# Altium schematic sheet MCU.SchDoc
size A4; SheetNumber: 3; SheetTotal: 4
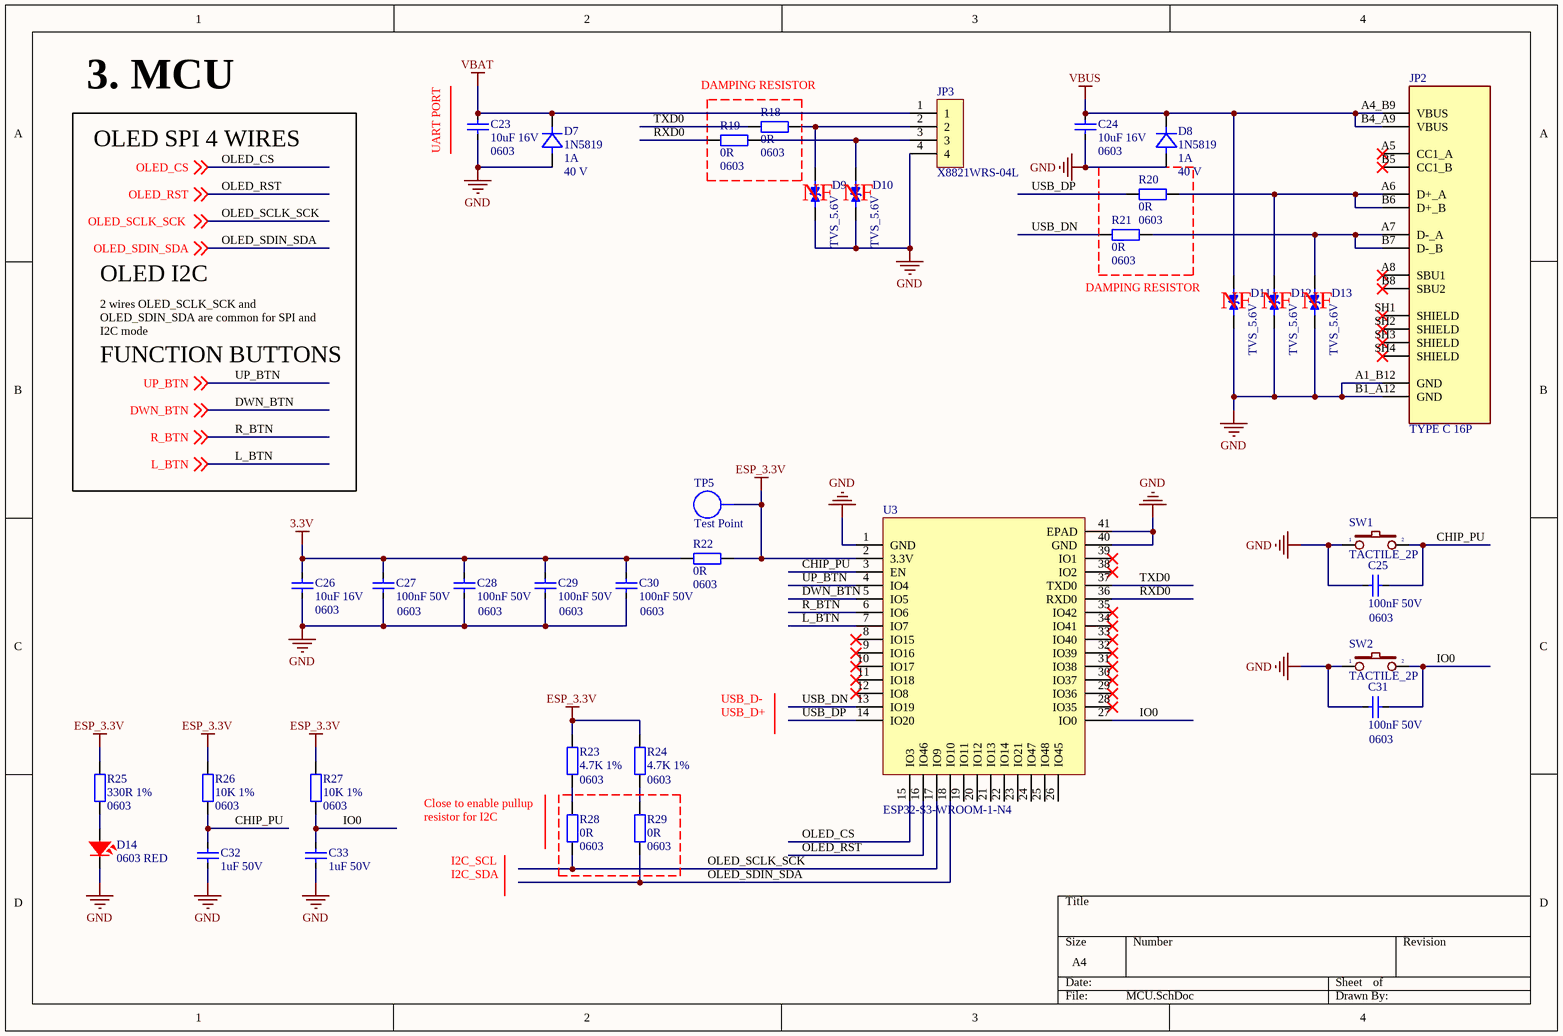
[diagram p0: MCU.SchDoc]

## Parts
C23  10uF 16V  Size: 0603  [CAP_SMD_0603]
C24  10uF 16V  Size: 0603  [CAP_SMD_0603]
C25  100nF 50V  Size: 0603  [CAP_SMD_0603]
C26  10uF 16V  Size: 0603  [CAP_SMD_0603]
C27  100nF 50V  Size: 0603  [CAP_SMD_0603]
C28  100nF 50V  Size: 0603  [CAP_SMD_0603]
C29  100nF 50V  Size: 0603  [CAP_SMD_0603]
C30  100nF 50V  Size: 0603  [CAP_SMD_0603]
C31  100nF 50V  Size: 0603  [CAP_SMD_0603]
C32  1uF 50V  [CAP_SMD_0603]
C33  1uF 50V  [CAP_SMD_0603]
D7  1N5819  Current - Average Rectified (Io): 1A  Voltage - DC Reverse (Vr) (Max): 40 V  [DIO-SMD-123]
D8  1N5819  Current - Average Rectified (Io): 1A  Voltage - DC Reverse (Vr) (Max): 40 V  [DIO-SMD-123]
D9  TVS_5.6V  [SOD_523]
D10  TVS_5.6V  [SOD_523]
D11  TVS_5.6V  [SOD_523]
D12  TVS_5.6V  [SOD_523]
D13  TVS_5.6V  [SOD_523]
D14  0603 RED  [LED-0603]
JP2  TYPE C 16P  [TYPE C 16P]
JP3  X8821WRS-04L  [CONN_X8821WRS-04L-LPSN]
R18  0R  Size: 0603  [RES_SMD_0603]
R19  0R  Size: 0603  [RES_SMD_0603]
R20  0R  Size: 0603  [RES_SMD_0603]
R21  0R  Size: 0603  [RES_SMD_0603]
R22  0R  Size: 0603  [RES_SMD_0603]
R23  4.7K 1%  Size: 0603  [RES_SMD_0603]
R24  4.7K 1%  Size: 0603  [RES_SMD_0603]
R25  330R 1%  Size: 0603  [RES_SMD_0603]
R26  10K 1%  Size: 0603  [RES_SMD_0603]
R27  10K 1%  Size: 0603  [RES_SMD_0603]
R28  0R  Size: 0603  [RES_SMD_0603]
R29  0R  Size: 0603  [RES_SMD_0603]
SW1  TACTILE_2P  [C&K SW 2P]
SW2  TACTILE_2P  [C&K SW 2P]
TP5  Test Point  [TEST_POINT]
U3  ESP32-S3-WROOM-1-N4  [ESP32-S3-WROOM-1]

## Nets
3.3V: C26.1 C27.2 C28.2 C29.2 C30.2 R22.2
ESP_3.3V: R22.1 R23.2 R24.2 R25.1 R26.2 R27.2 TP5.1 U3.2(3.3V)
GND: C23.2 C24.2 C25.1 C26.2 C27.1 C28.1 C29.1 C30.1 C31.1 C32.1 C33.1 D7.A D8.A D9.1 D10.1 D11.1 D12.1 D13.1 D14.2 JP2.A1_B12(GND) JP2.B1_A12(GND) JP3.4 SW1.1 SW2.1 U3.1(GND) U3.40(GND) U3.41(EPAD)
VBAT: C23.1 D7.C JP3.1
VBUS: C24.1 D8.C D11.2 JP2.A4_B9(VBUS) JP2.B4_A9(VBUS)
CHIP_PU: C25.2 C32.2 R26.1 SW1.2 U3.3(EN)
DWN_BTN: U3.5(IO5) ; off-sheet DWN_BTN
IO0: C31.2 C33.2 R27.1 SW2.2 U3.27(IO0)
L_BTN: U3.7(IO7) ; off-sheet L_BTN
OLED_CS: U3.15(IO3) ; off-sheet OLED_CS
OLED_RST: U3.16(IO46) ; off-sheet OLED_RST
OLED_SCLK_SCK: R28.2 U3.17(IO9) ; off-sheet OLED_SCLK_SCK   [also labelled OLED_SCLK_SCK ]
OLED_SDIN_SDA: R29.2 U3.18(IO10) ; off-sheet OLED_SDIN_SDA  [also labelled OLED_SDIN_SDA ]
R_BTN: U3.6(IO6) ; off-sheet R_BTN
RXD0: R19.2 U3.36(RXD0)
TXD0: R18.2 U3.37(TXD0)
UP_BTN: U3.4(IO4) ; off-sheet UP_BTN
USB_DN: R21.2 U3.13(IO19)
USB_DP: R20.2 U3.14(IO20)
NetD9_2: D9.2 JP3.2 R18.1
NetD10_2: D10.2 JP3.3 R19.1
NetD12_2: D12.2 JP2.A6(D+_A) JP2.B6(D+_B) R20.1
NetD13_2: D13.2 JP2.A7(D-_A) JP2.B7(D-_B) R21.1
NetD14_1: D14.1 R25.2
NetR23_1: R23.1 R28.1
NetR24_1: R24.1 R29.1

Not connected (* = marked no-connect by the designer): JP2 A5(CC1_A)* A8(SBU1)* B5(CC1_B)* B8(SBU2)* SH1(SHIELD)* SH2(SHIELD)* SH3(SHIELD)* SH4(SHIELD)*; U3 8(IO15)* 9(IO16)* 10(IO17)* 11(IO18)* 12(IO8)* 19(IO11) 20(IO12) 21(IO13) 22(IO14) 23(IO21) 24(IO47) 25(IO48) 26(IO45) 28(IO35)* 29(IO36)* 30(IO37)* 31(IO38)* 32(IO39)* 33(IO40)* 34(IO41)* 35(IO42)* 38(IO2)* 39(IO1)*

## Notes on the sheet
- 3. MCU
- DAMPING RESISTOR
- OLED SPI 4 WIRES
- (near C23) UART PORT
- (near D9) NF
- (near D10) NF
- OLED I2C
- (near D11) NF
- (near D12) NF
- (near D13) NF
- 2 wires OLED_SCLK_SCK and OLED_SDIN_SDA are common for SPI and I2C mode
- FUNCTION BUTTONS
- USB_D-
- USB_D+
- Close to enable pullup resistor for I2C
- I2C_SCL
- I2C_SDA

## Library data of the parts
C23 C24 C26 = C0603_MLCC_10uF_16V: 10 µF ±20% 16V Ceramic Capacitor X6S 0603 (1608 Metric); Manufacturer: Murata Electronics; Manufacture Part Number: GRM188C81C106MA73D; Packaging: Cut Tape (CT); Link: https://www.digikey.cn/en/products/detail/murata-electronics/GRM188C81C106MA73D/3900463; Price: $0.25
C25 C27-C31 = C0603_MLCC_100nF_50V: 0.1 µF ±10% 50V Ceramic Capacitor X7R 0603 (1608 Metric); Manufacturer: Samsung Electro-Mechanics; Manufacture Part Number: CL10B104KB8NNNC; Packaging: Cut Tape (CT); Link: https://www.digikey.cn/en/products/detail/samsung-electro-mechanics/CL10B104KB8NNNC/3886658; Price: $0.10
C32 C33 = C0603_MLCC_1uF_50V: 1 µF ±10% 50V Ceramic Capacitor X5R 0603 (1608 Metric); Manufacturer: Samsung Electro-Mechanics; Manufacture Part Number: CL10A105KB8NNNC; Packaging: Cut Tape (CT); Link: https://www.digikey.cn/en/products/detail/samsung-electro-mechanics/CL10A105KB8NNNC/3887518; Price: $0.14; Size: 0603
D7 D8 = 1N5819: Diode 40 V 1A Surface Mount SOD-123; Manufacturer: Diodes Incorporated; Manufacture Part Number: 1N5819HW-7-F; Voltage - Forward (Vf) (Max) @ If: 450 mV @ 1 A; Capacitance @ Vr, F: 60pF @ 4V, 1MHz; Packaging: Cut Tape (CT); Link: https://www.digikey.cn/en/products/detail/diodes-incorporated/1N5819HW-7-F/814970; Price: $0.43; Operating Temperature - Junction: -65°C ~ 125°C
D9-D13 = TVS_5.6V: 9.4A 18.6V 5.6V Bi-Directional 5V SOD-523 Electrostatic and Surge Protection (TVS/ESD) ROHS; Manufacturer: LRC; Manufacture Part Number: LESD5D5.0CT1G; Voltage - Reverse Standoff (Typ): 4V; Voltage - Breakdown (Min): 6V; Voltage - Clamping (Max) @ Ipp: 8V; Packaging: Cut Tape (CT); Link: https://www.lcsc.com/product-detail/New-Arrivals_Leshan-Radio-LESD5D5-0CT1G_C383211.html; Price: $ 0.0149
D14 = LED_0603_RED: Red 625nm LED Indication - Discrete 2V 0603 (1608 Metric); Manufacturer: Würth Elektronik; Manufacture Part Number: 150060RS75000; Packaging: Cut Tape (CT); Link: https://www.digikey.cn/en/products/detail/w%C3%BCrth-elektronik/150060RS75000/4489901; Price: $0.15
JP2 = TYPE_C_16P: USB-C (USB TYPE-C) USB 2.0 Receptacle Connector 24 (16+8 Dummy) Position Surface Mount, Right Angle; Through Hole; Manufacturer: Amphenol ICC (Commercial Products); Manufacture Part Number: 12402012E212A; Packaging: Cut Tape; Link: https://www.digikey.cn/en/products/detail/amphenol-cs-commercial-products/12402012E212A/13683192; Price: $0.79
JP3 = X8821WRS-04L: 1x4P 4P XH 1 Tin 2.5mm 4 3A Brass Surface Mount，Right Angle SMD,P=2.5mm,Surface Mount，Right Angle Wire To Board Connector ROHS; Manufacturer: XKB Connection; Manufacture Part Number: X8821WRS-04-9TSN; Link: https://www.lcsc.com/product-detail/Wire-To-Board-Connector_XKB-Connection-X8821WRS-04-9TSN_C397434.html; Price: $ 0.1564
R18-R22 R28 R29 = R0603_0R: 0 Ohms Jumper Chip Resistor 0603 (1608 Metric) Automotive AEC-Q200 Thick Film; Manufacturer: Stackpole Electronics Inc; Manufacture Part Number: RMCF0603ZT0R00; Packaging: Cut Tape (CT); Link: https://www.digikey.cn/en/products/detail/stackpole-electronics-inc/RMCF0603ZT0R00/1756908; Price: $0.10
R23 R24 = R0603_4.7K: 4.7 kOhms ±1% 0.1W, 1/10W Chip Resistor 0603 (1608 Metric) Moisture Resistant Thick Film; Manufacturer: YAGEO; Manufacture Part Number: RC0603FR-074K7L; Packaging: Cut Tape (CT); Link: https://www.digikey.com/en/products/detail/yageo/RC0603FR-074K7L/727212; Price: $0.10
R25 = R0603_330R: 330 Ohms ±1% 0.1W, 1/10W Chip Resistor 0603 (1608 Metric) Thick Film; Manufacturer: TE Connectivity Passive Product; Manufacture Part Number: CRG0603F330R; Packaging: Cut Tape (CT); Link: https://www.digikey.cn/en/products/detail/te-connectivity-passive-product/CRG0603F330R/2380765; Price: $0.10
R26 R27 = R0603_10K: 10 kOhms ±1% 0.1W, 1/10W Chip Resistor 0603 (1608 Metric) Moisture Resistant Thick Film; Manufacturer: YAGEO; Manufacture Part Number: RC0603FR-0710KL; Packaging: Cut Tape (CT); Link: https://www.digikey.cn/en/products/detail/yageo/RC0603FR-0710KL/726880; Price: $0.10
SW1 SW2 = SWITCH_TACTILE_SPST: Tactile Switch SPST-NO Top Actuated Surface Mount; Manufacturer: C&K; Manufacture Part Number: PTS636 SM25F SMTR LFS; Packaging: Cut Tape (CT); Link: https://www.digikey.cn/en/products/detail/c-k/PTS636-SM25F-SMTR-LFS/10071742?s=N4IgTCBcDaIAoBUDKA2AzCgBEgsmArAGLY4IBKmAMoUiALoC%2BQA; Price: $0.24
TP5 = TEST_POINT
U3 = ESP32-S3-WROOM-1-N4: SMD,18x25.5mm WiFi Modules ROHS; Manufacturer: Espressif Systems; Manufacture Part Number: ESP32-S3-WROOM-1-N4; Packaging: Cut Tape (CT); Link: https://www.lcsc.com/product-detail/WiFi-Modules_Espressif-Systems-ESP32-S3-WROOM-1-N4_C2913197.html; Price: $ 3.71